# EAGLE design ACinputSide (EAGLE 6.6.0)
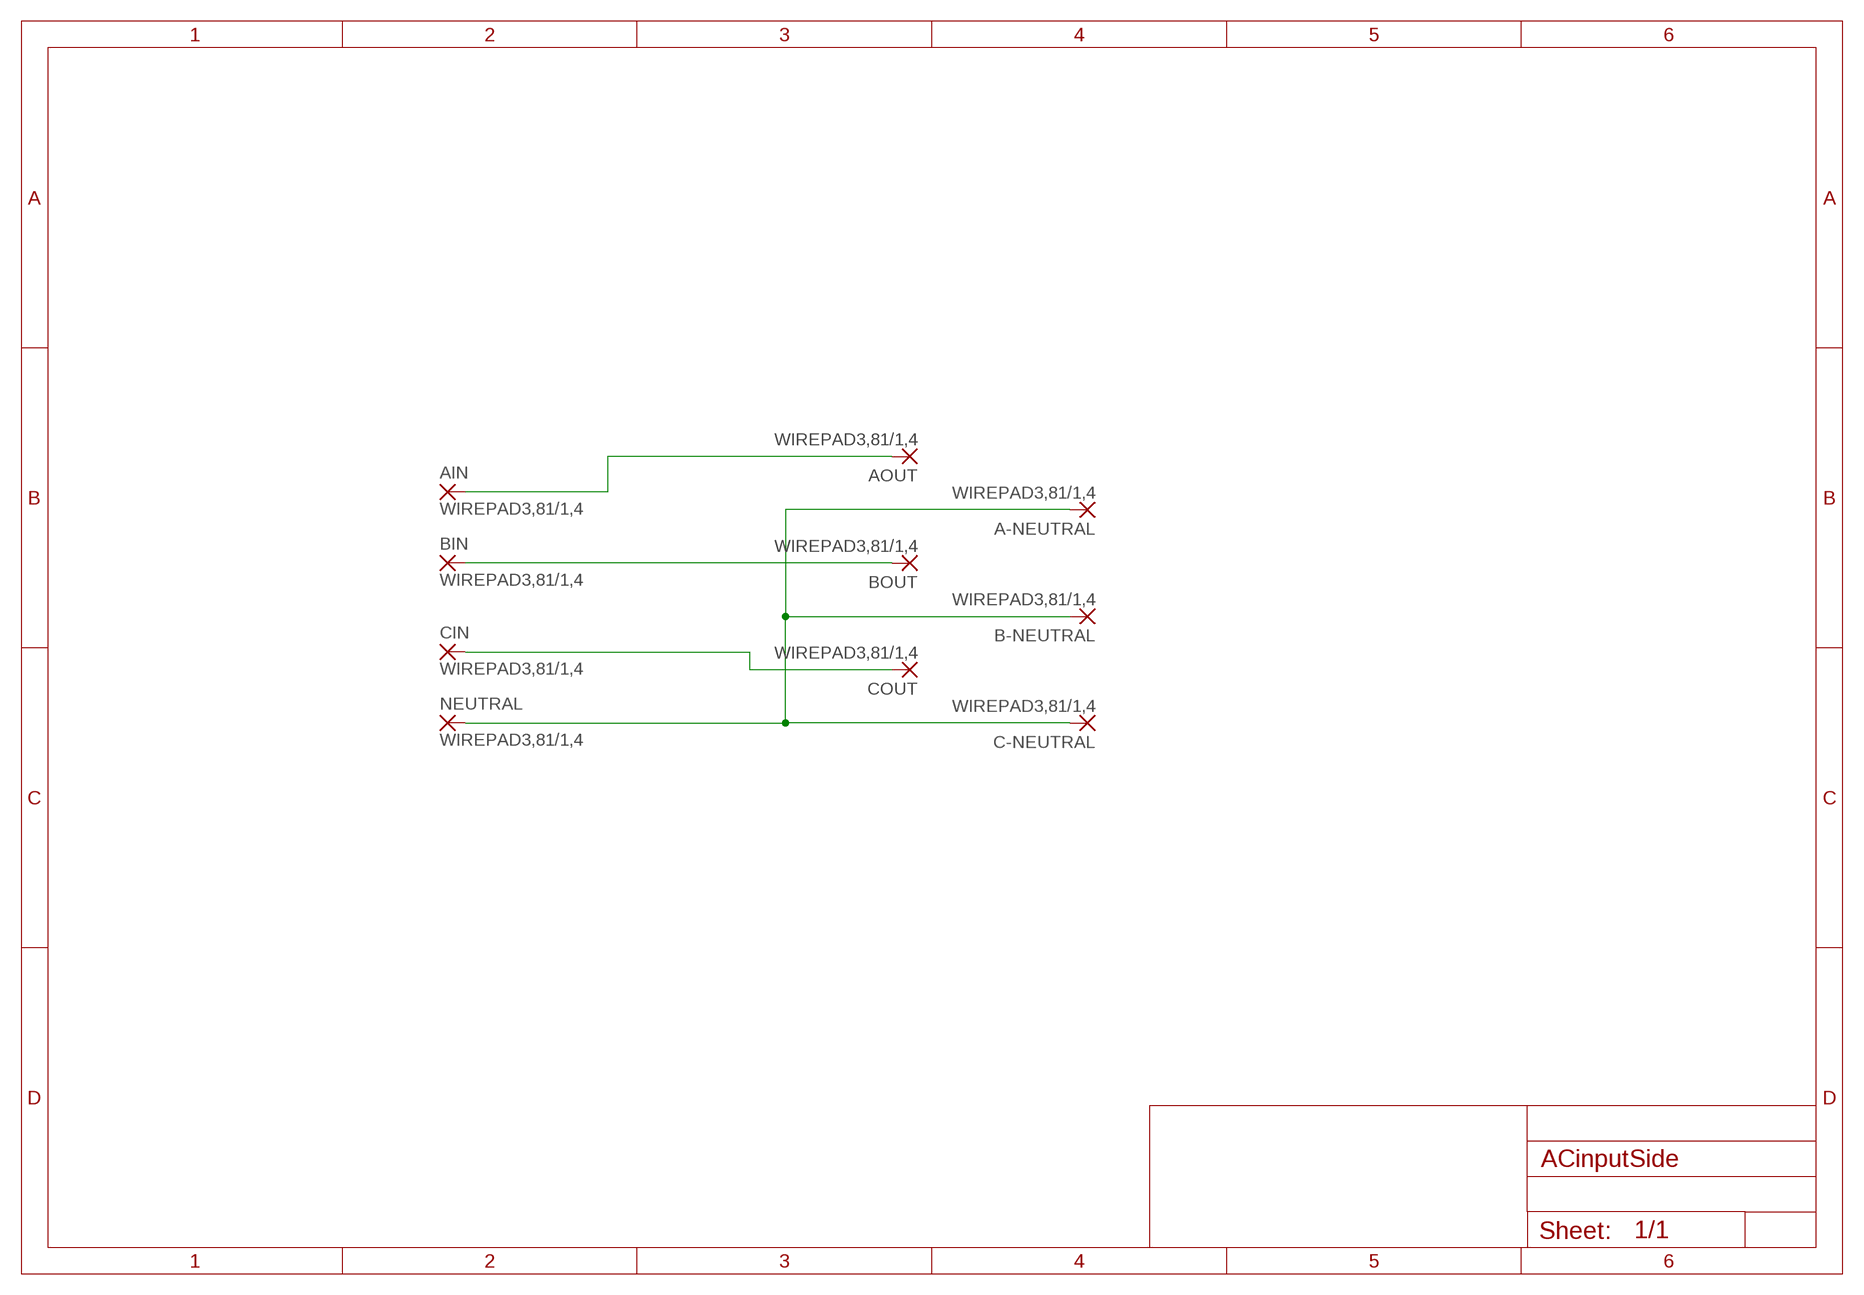
[diagram p0: schematic, sheet 1]

## Parts
A-NEUTRAL  WIREPAD3,81/1,4  [3,81/1,4]
AIN  WIREPAD3,81/1,4  [3,81/1,4]
AOUT  WIREPAD3,81/1,4  [3,81/1,4]
B-NEUTRAL  WIREPAD3,81/1,4  [3,81/1,4]
BIN  WIREPAD3,81/1,4  [3,81/1,4]
BOUT  WIREPAD3,81/1,4  [3,81/1,4]
C-NEUTRAL  WIREPAD3,81/1,4  [3,81/1,4]
CIN  WIREPAD3,81/1,4  [3,81/1,4]
COUT  WIREPAD3,81/1,4  [3,81/1,4]
NEUTRAL  WIREPAD3,81/1,4  [3,81/1,4]

## Nets
N$1: A-NEUTRAL.1(P) B-NEUTRAL.1(P) C-NEUTRAL.1(P) NEUTRAL.1(P)
N$2: CIN.1(P) COUT.1(P)
N$4: BIN.1(P) BOUT.1(P)
N$5: AIN.1(P) AOUT.1(P)

## Library data of the parts
A-NEUTRAL AIN AOUT B-NEUTRAL BIN BOUT C-NEUTRAL CIN COUT NEUTRAL = wirepad:WIREPAD: Wire PAD connect wire on PCB

## Board
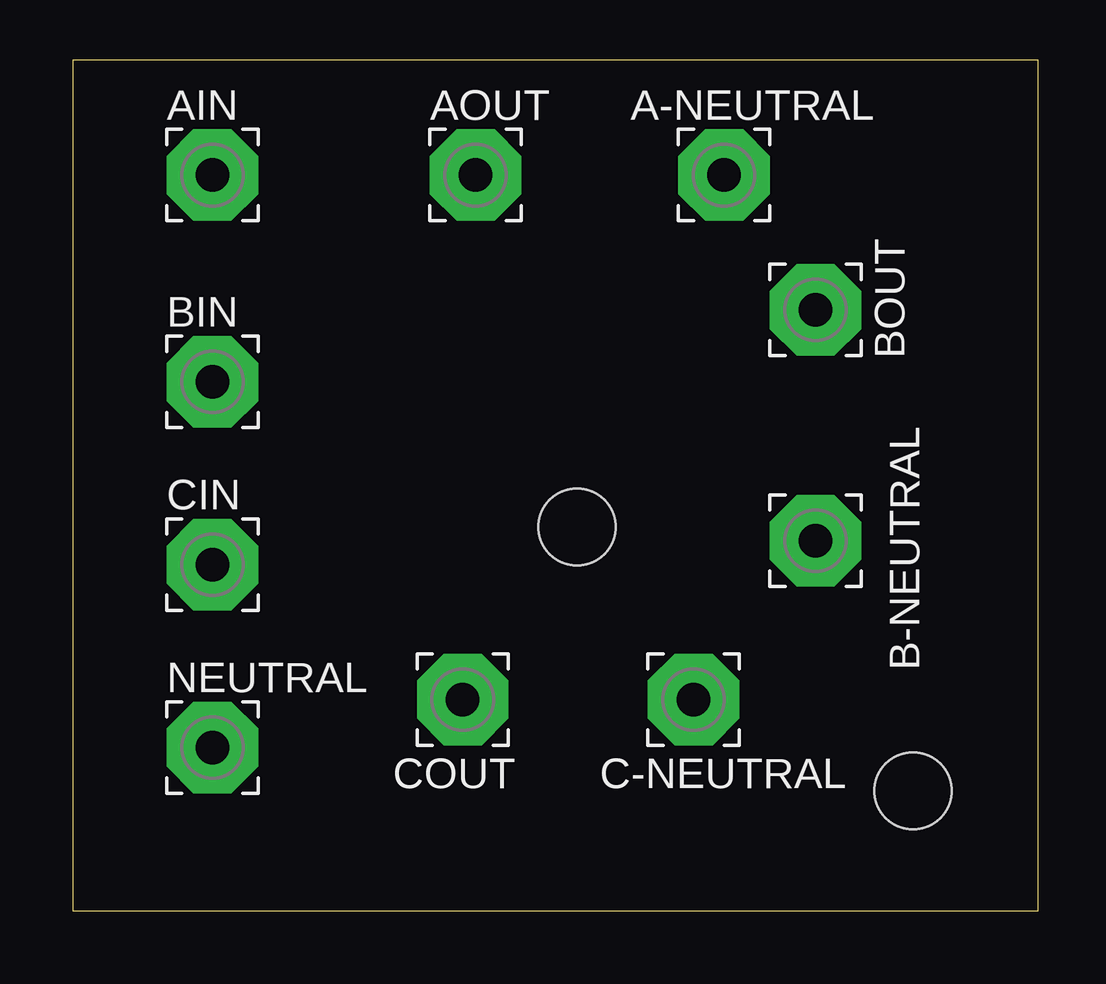
[diagram p1: board, top side]
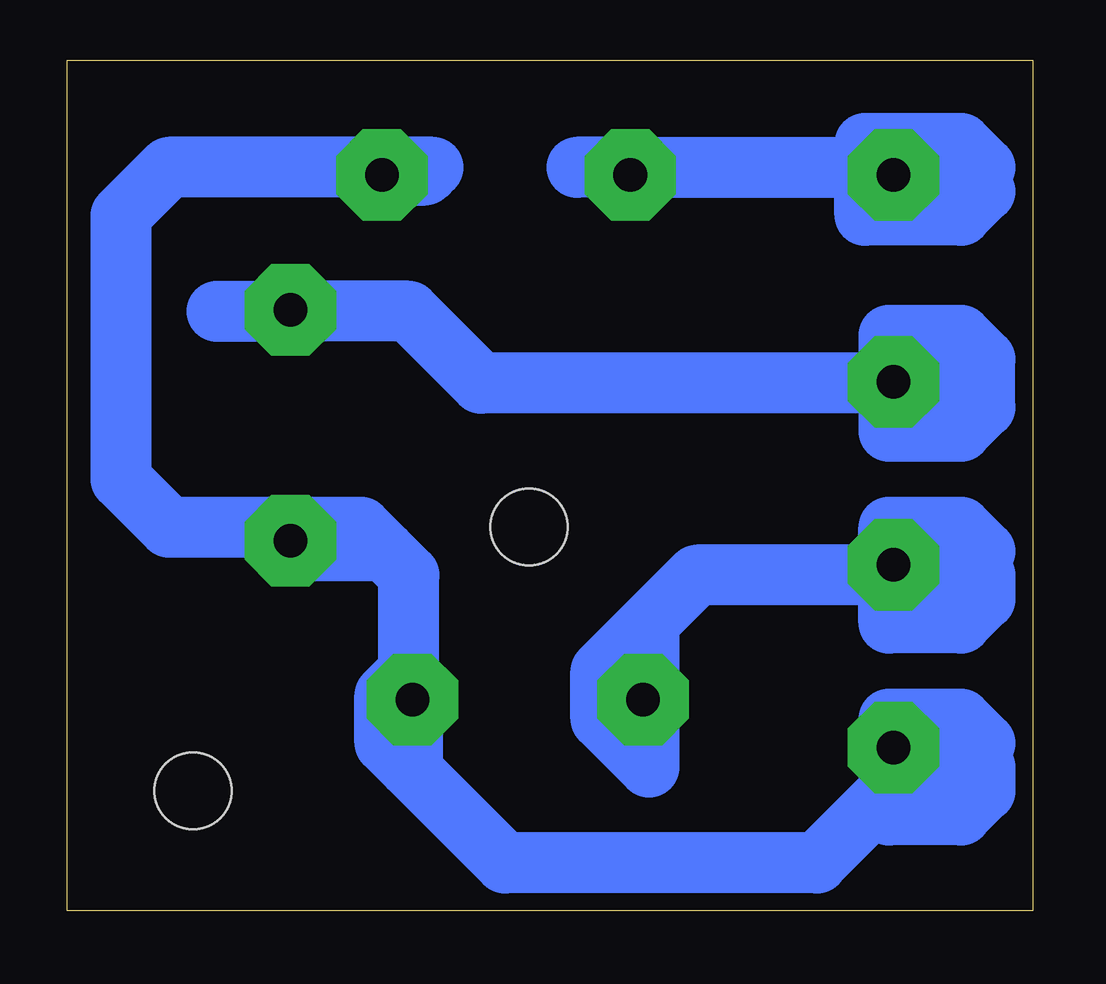
[diagram p2: board, bottom side, seen from below]

Size 40.23 x 35.47 mm. Coordinates in mm from the lower left corner, seen from the top.
Outline: 0,0 40.23,0 40.23,35.47 0,35.47 0,0
Copper layers (1*16): Top 0.035mm / dielectric 1.5mm / Bottom 0.035mm
Design rules "default *": minimum track width 10mil, minimum drill 24mil, track to track 15mil, track to pad 15mil, pad to pad 8mil, via to via 8mil, smd to smd 8mil, copper to edge 40mil, drill to drill 8mil, minimum pad ring 10mil, minimum via ring 8mil, stop-mask expansion 4mil, vias tented up to drill 0mil, thermal gap 10mil
Holes 3.2 mm at 21,16 35,5

### Footprints (pad centres in the part's own frame; a part is rotated, then mirrored left to right if it is on the bottom)
3,81/1,4 = drill 1.397 pad 3.81 octagon: 1 0,0

### Placement (x,y rotation side)
A-NEUTRAL  27.13,30.67 0 top
AIN  5.81,30.67 0 top
AOUT  16.78,30.67 0 top
B-NEUTRAL  30.94,15.43 0 top
BIN  5.81,22.05 0 top
BOUT  30.94,25.05 0 top
C-NEUTRAL  25.86,8.81 0 top
CIN  5.81,14.43 0 top
COUT  16.24,8.81 0 top
NEUTRAL  5.81,6.81 0 top

### Tracks (layer width: path | path; a pad name or v marks a point on that pad's centre or on a via)
N$1
  Bottom 2.54: A-NEUTRAL.1 25.33,30.67 25,31 36,31 38,29 38,18 36,16 28,16 27,15 | 27,15 30.51,15 B-NEUTRAL.1 | C-NEUTRAL.1 25.86,6.14 26,6 | 26,6 27,7 27,9 26,10 | 26,10 26,9 | 26,10 26,14 27,15 | NEUTRAL.1 2.81,6.81 2,6 2,5 3,4 6,4 6,5 | 6,6 6,8 3,8 2,7 3,7 5,5 6,6 | 6,6 6,5 | 6,5 9,2 22,2 26,6
N$2
  Bottom 2.54: CIN.1 2.43,14.43 2,14 2,13 3,12 6,12 6,14 | 6,14 6,16 3,16 2,15 3,14 6,14 | 6,14 14,14 16,12 | 16,9.05 16,6 18,8 18,10 16,12 | 16,12 16,9.05 | 16,9.05 COUT.1
N$4
  Bottom 2.54: BIN.1 5.81,23.81 | 5.81,23.81 6,24 | 6,24 6,22 | 6,22 6,20 5,20 | 5,20 3,20 2,21 2,23 | 2,23 5,23 5.81,23.81 | 6,24 3,24 2,23 | 2,23 5,20 | 5,20 5,21 6,22 | 6,22 23,22 26,25 30.99,25 | 34,25 30.99,25 | 30.99,25 BOUT.1
N$5
  Bottom 2.54: AIN.1 5,30.67 | 5,30.67 2.67,30.67 2,30 3,29 7,29 7,32 3,32 2,31 | 16.45,31 AOUT.1 | 16.45,31 19,31 | 16.45,31 5.33,31 5,30.67